# EAGLE design ATMEGA32u4_Breakout_rev1 (EAGLE 9.4.0)
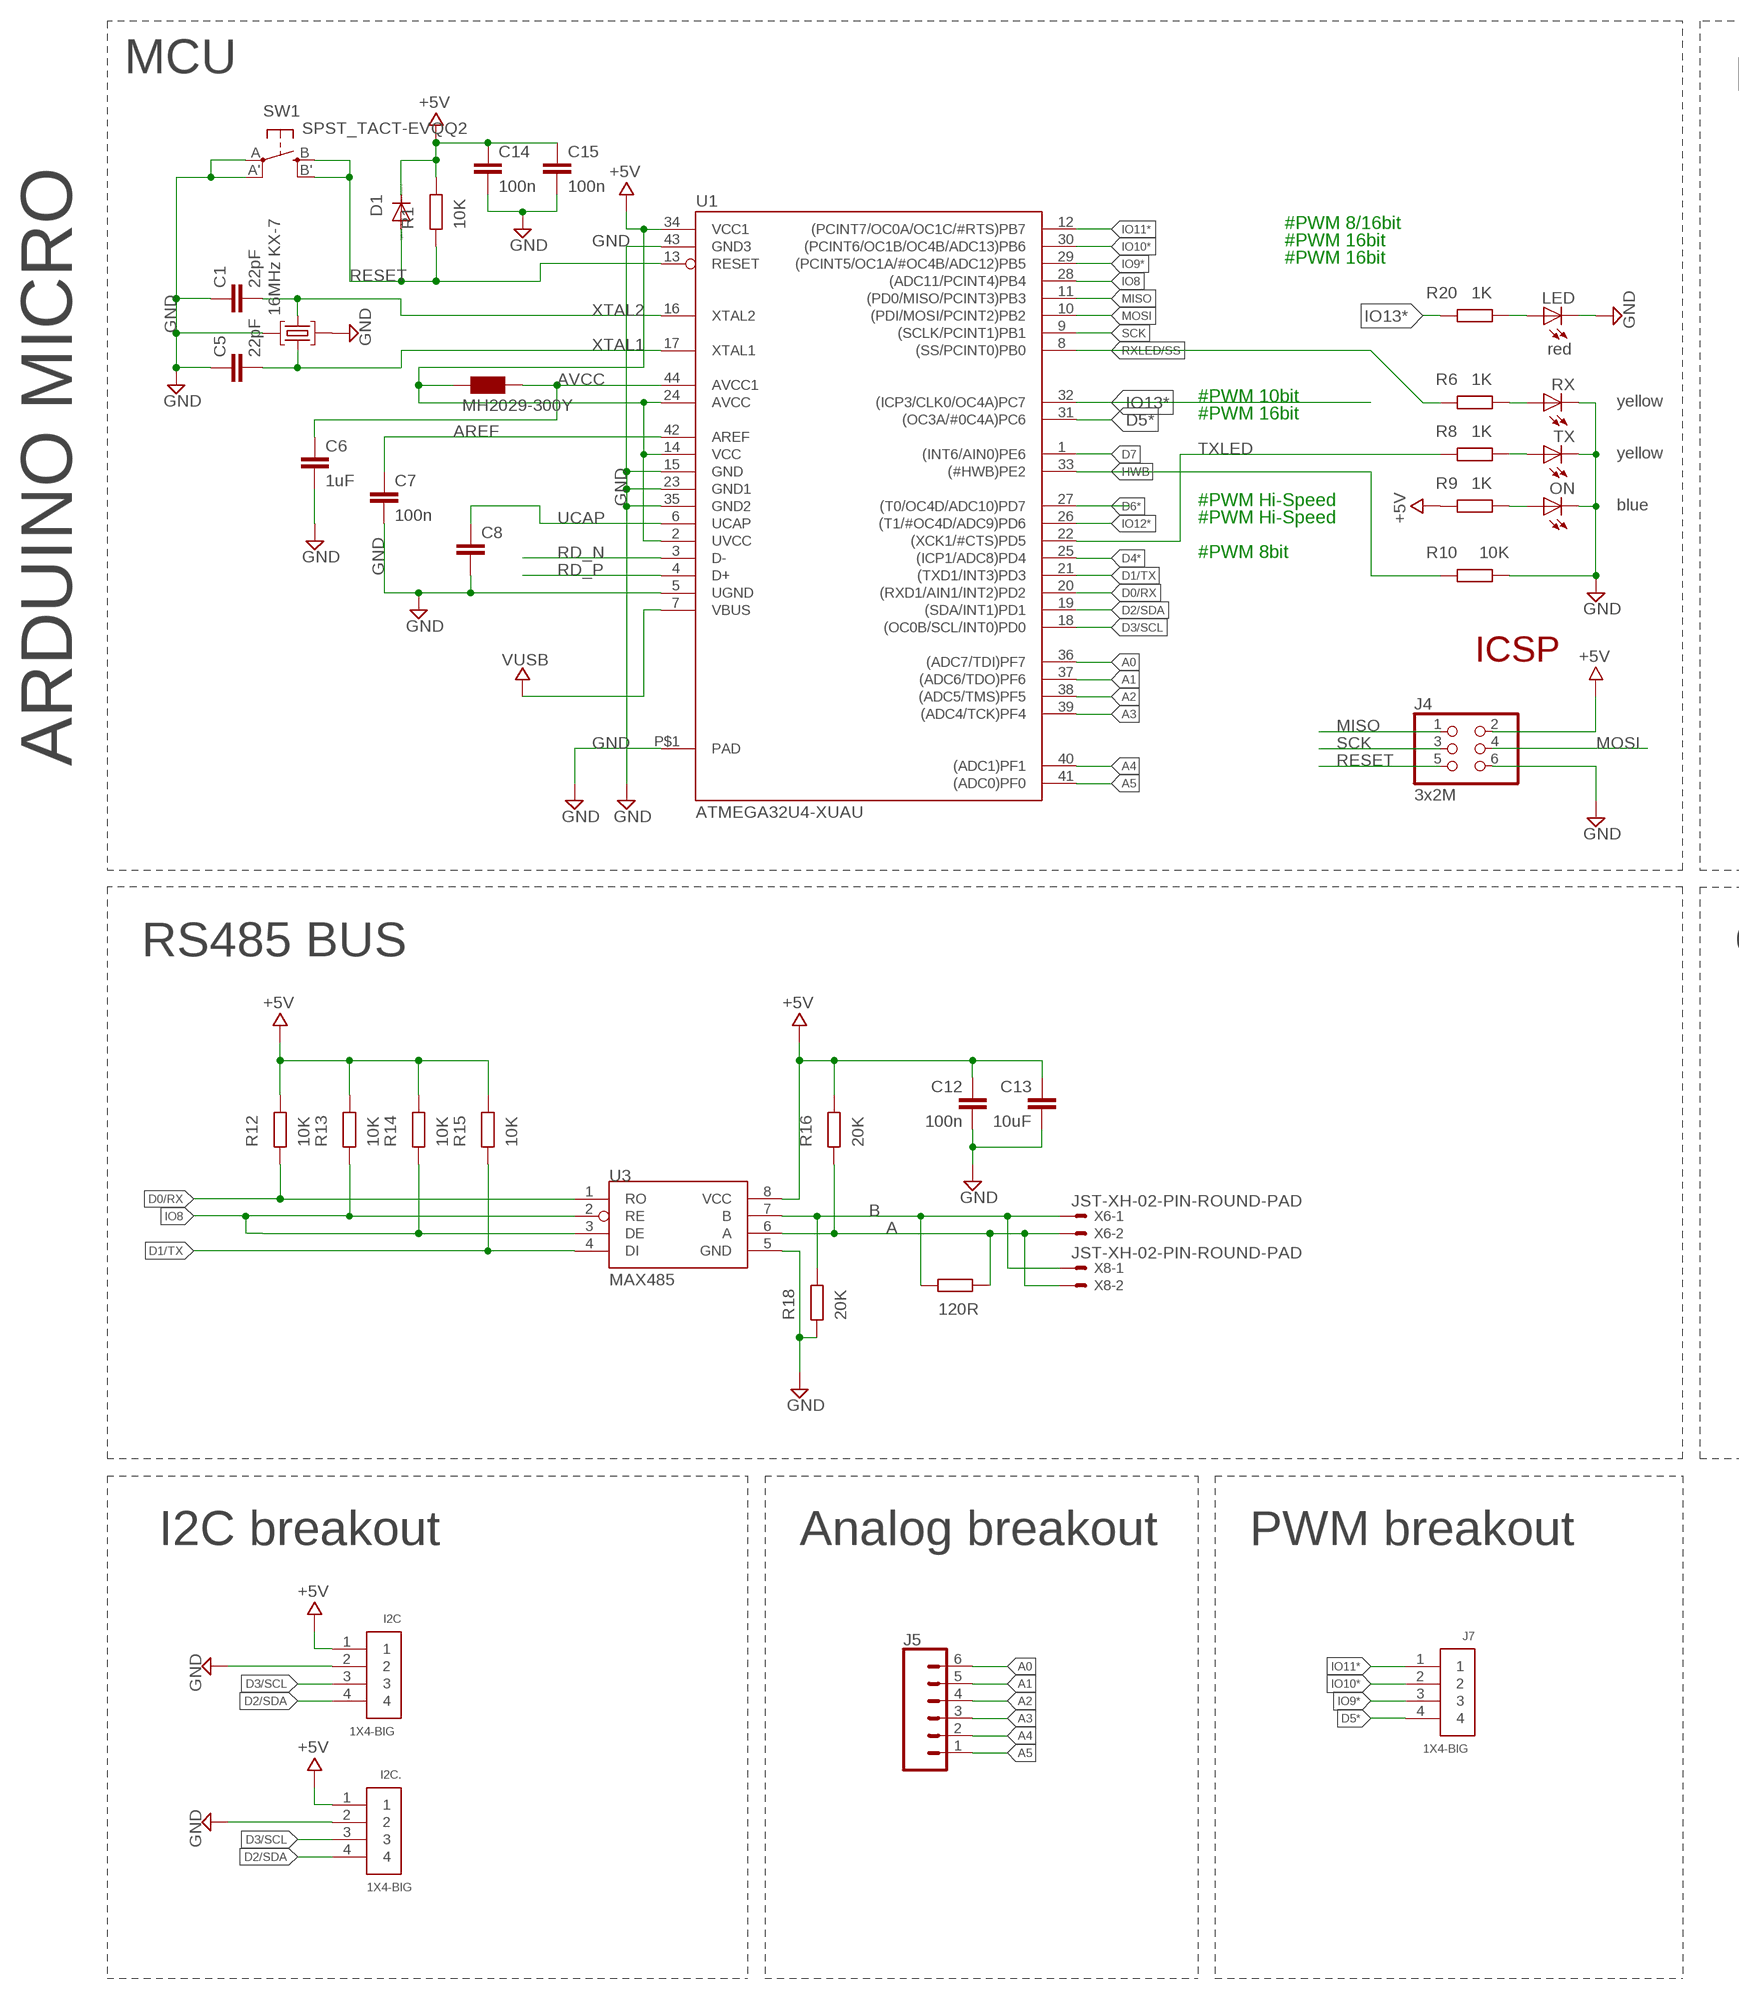
[diagram p0: schematic, sheet 1, part 1 of 2]
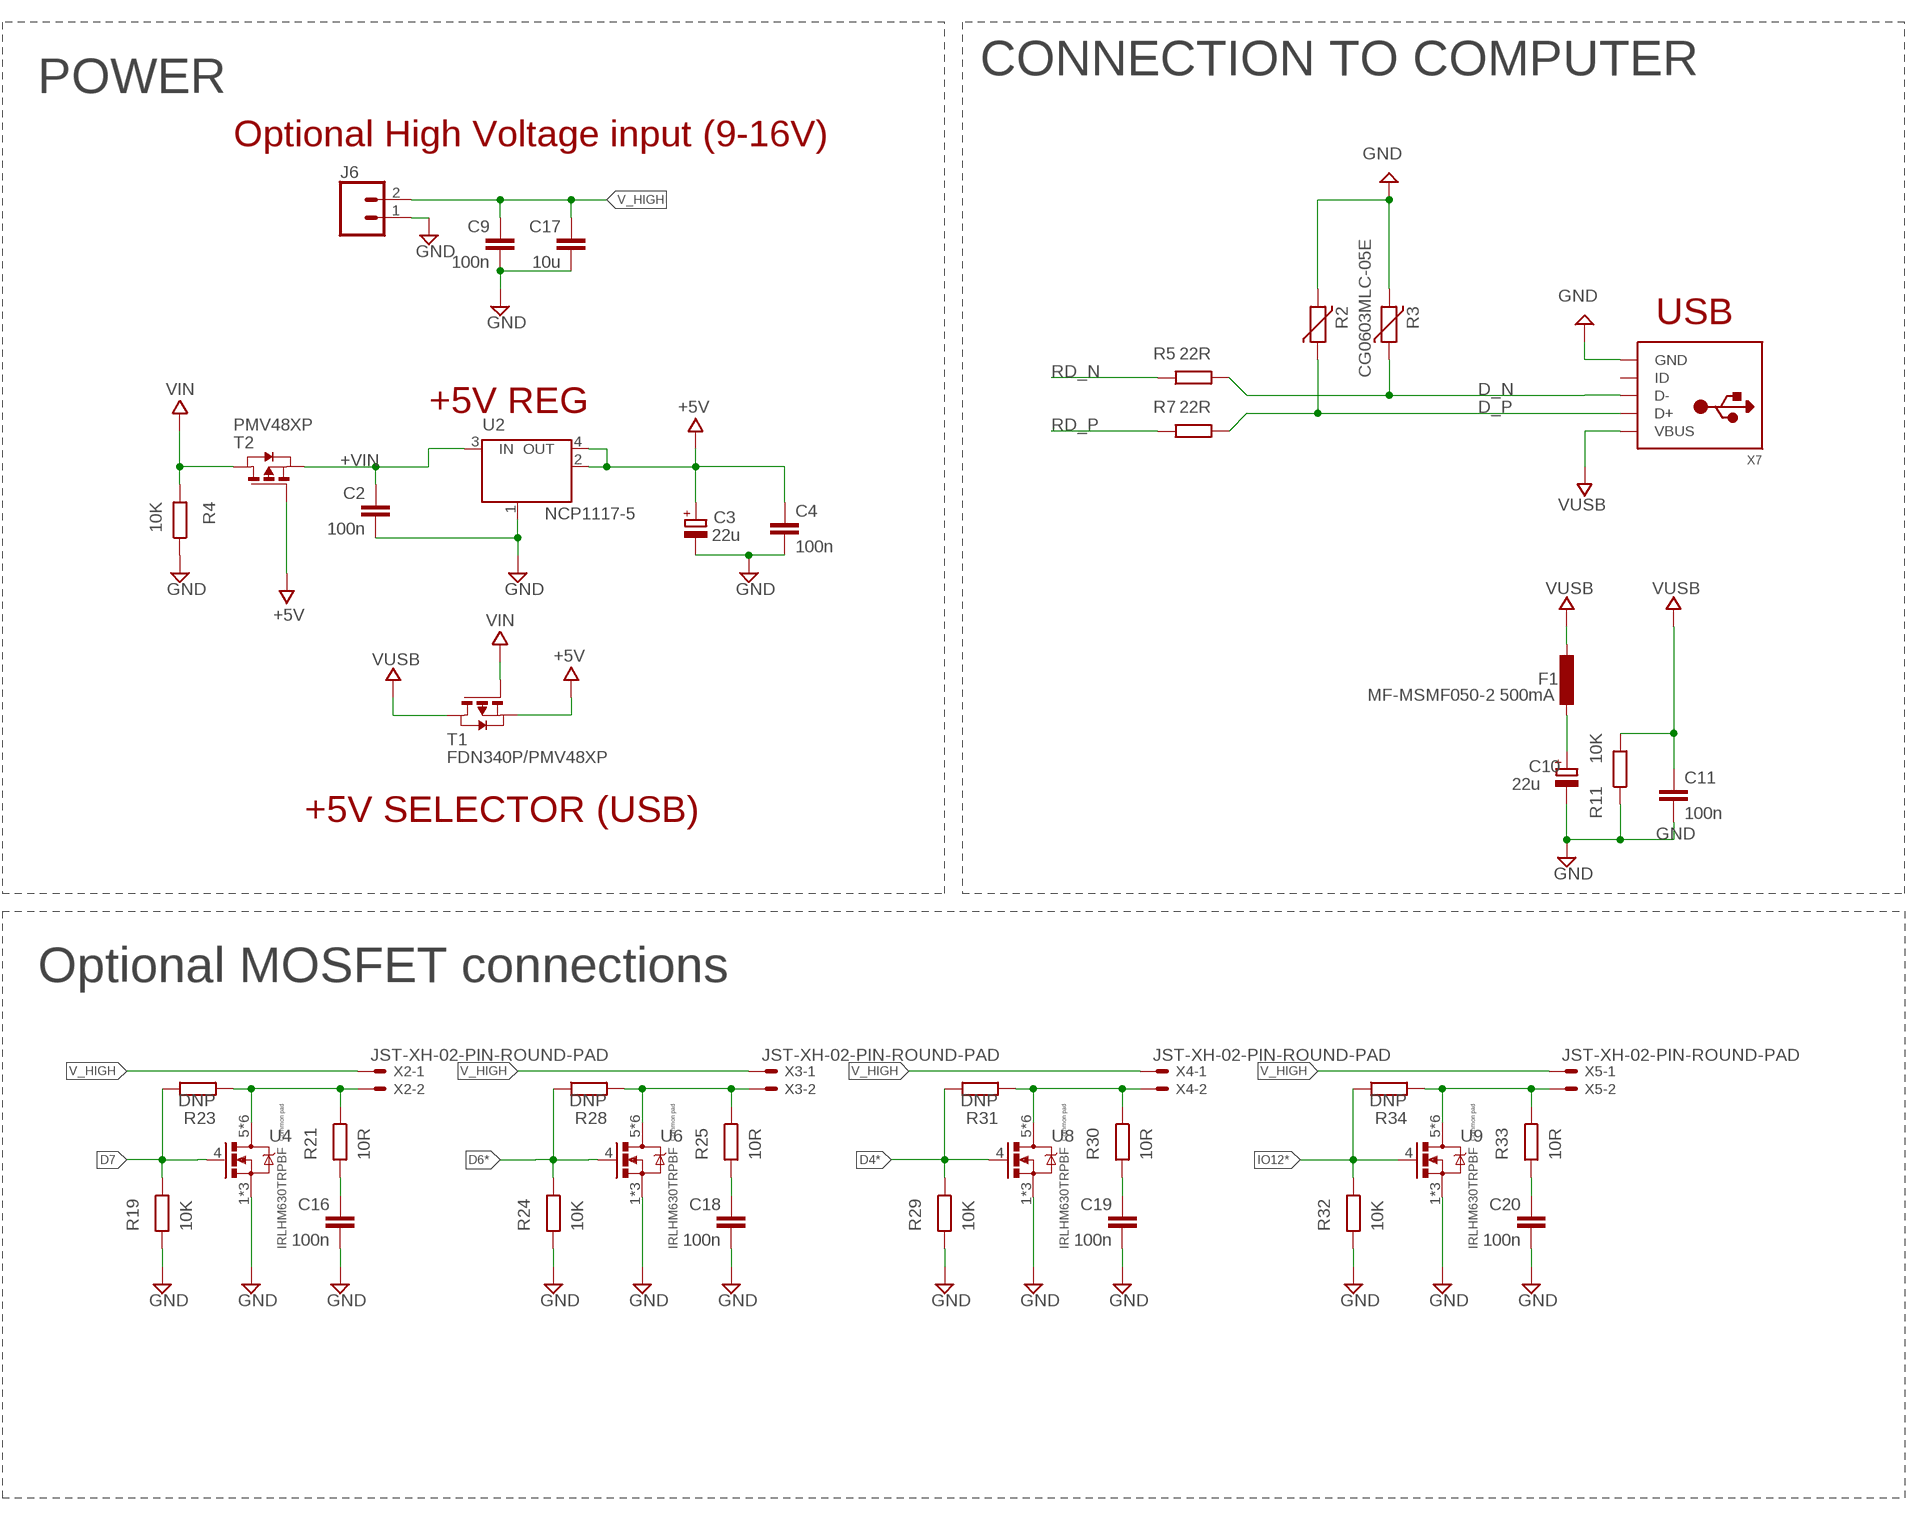
[diagram p1: schematic, sheet 1, part 2 of 2]

## Parts
C1  22pF  C-EUC0603  [C0603-ROUND]
C2  100n  C-EUC0603  [C0603-ROUND]
C3  22u  CPOL-EUSMCB  [SMC_B]
C4  100n  C-EUC0603  [C0603-ROUND]
C5  22pF  C-EUC0603  [C0603-ROUND]
C6  1uF  C-EUC0603  [C0603-ROUND]
C7  100n  C-EUC0603  [C0603-ROUND]
C8  1uF  C-EUC0603  [C0603-ROUND]
C9  100n  C-EUC1206  [C1206]
C10  22u  CPOL-EUSMCB  [SMC_B]
C11  100n  C-EUC0603  [C0603-ROUND]
C12  100n  C-EUC0603  [C0603-ROUND]
C13  10uF  C-EUC0603  [C0603-ROUND]
C14  100n  C-EUC0603  [C0603-ROUND]
C15  100n  C-EUC0603  [C0603-ROUND]
C16  100n  C-EUC0603  [C0603-ROUND]
C17  10u  C-EUC1206  [C1206]
C18  100n  C-EUC0603  [C0603-ROUND]
C19  100n  C-EUC0603  [C0603-ROUND]
C20  100n  C-EUC0603  [C0603-ROUND]
D1  CD1206-S01575  DIODE-MINIMELF  [MINIMELF]
F1  MF-MSMF050-2 500mA  L-EUL1812  [L1812]
I2C  1X4-BIG  [1X04-BIG]
I2C.  1X4-BIG  [1X04-BIG]
J4  3x2M  PINHD-2X3  [2X03]
J5  CONN_06SILK_FEMALE_PTH  [1X06]
J6  CONN_023.5MM  [SCREWTERMINAL-3.5MM-2]
J7  1X4-BIG  [1X04-BIG]
L2  MH2029-300Y  WE-CBF_0805  [0805]
LED  red  LEDCHIPLED_0805  [CHIPLED_0805]
ON  blue  LEDCHIPLED_0805  [CHIPLED_0805]
R1  10K  R-EU_R0603  [R0603-ROUND]
R2  CG0603MLC-05E  VARISTORCN0603  [CT/CN0603]
R3  CG0603MLC-05E  VARISTORCN0603  [CT/CN0603]
R4  10K  R-EU_R0603  [R0603-ROUND]
R5  22R  R-EU_R0603  [R0603-ROUND]
R6  1K  R-EU_R0603  [R0603-ROUND]
R7  22R  R-EU_R0603  [R0603-ROUND]
R8  1K  R-EU_R0603  [R0603-ROUND]
R9  1K  R-EU_R0603  [R0603-ROUND]
R10  10K  R-EU_R0603  [R0603-ROUND]
R11  10K  R-EU_R0603  [R0603-ROUND]
R12  10K  R-EU_R0603  [R0603-ROUND]
R13  10K  R-EU_R0603  [R0603-ROUND]
R14  10K  R-EU_R0603  [R0603-ROUND]
R15  10K  R-EU_R0603  [R0603-ROUND]
R16  20K  R-EU_R0603  [R0603-ROUND]
R17  120R  R-EU_R0603  [R0603-ROUND]
R18  20K  R-EU_R0603  [R0603-ROUND]
R19  10K  R-EU_R0603  [R0603-ROUND]
R20  1K  R-EU_R0603  [R0603-ROUND]
R21  10R  R-EU_R0603  [R0603-ROUND]
R23  DNP  R-EU_R0603  [R0603-ROUND]
R24  10K  R-EU_R0603  [R0603-ROUND]
R25  10R  R-EU_R0603  [R0603-ROUND]
R28  DNP  R-EU_R0603  [R0603-ROUND]
R29  10K  R-EU_R0603  [R0603-ROUND]
R30  10R  R-EU_R0603  [R0603-ROUND]
R31  DNP  R-EU_R0603  [R0603-ROUND]
R32  10K  R-EU_R0603  [R0603-ROUND]
R33  10R  R-EU_R0603  [R0603-ROUND]
R34  DNP  R-EU_R0603  [R0603-ROUND]
RX  yellow  LEDCHIPLED_0805  [CHIPLED_0805]
SW1  SPST_TACT-EVQQ2  [EVQ-Q2]
T1  FDN340P/PMV48XP  PMOSSOT23  [SOT-23]
T2  PMV48XP  PMOSSOT23  [SOT-23]
TX  yellow  LEDCHIPLED_0805  [CHIPLED_0805]
U1  ATMEGA32U4-XUAU  [TQFP44-PAD]
U2  NCP1117-5  LINEAR_MC33269ST  [SOT223]
U3  MAX485  [SO08]
U4  IRLHM630TRPBF  [IRLHM630TRPBF]
U6  IRLHM630TRPBF  [IRLHM630TRPBF]
U8  IRLHM630TRPBF  [IRLHM630TRPBF]
U9  IRLHM630TRPBF  [IRLHM630TRPBF]
X1  16MHz KX-7  CRYSTAL-3.2-2.5  [CRYSTAL-3.2-2.5]
X2  JST-XH-02-PIN-ROUND-PAD  [JST-XH-02-PACKAGE-ROUND-PAD]
X3  JST-XH-02-PIN-ROUND-PAD  [JST-XH-02-PACKAGE-ROUND-PAD]
X4  JST-XH-02-PIN-ROUND-PAD  [JST-XH-02-PACKAGE-ROUND-PAD]
X5  JST-XH-02-PIN-ROUND-PAD  [JST-XH-02-PACKAGE-ROUND-PAD]
X6  JST-XH-02-PIN-ROUND-PAD  [JST-XH-02-PACKAGE-ROUND-PAD]
X7  MICROBUILDER_USB_MICRO_20329_V2  [MICROBUILDER_4UCONN_20329_V2]
X8  JST-XH-02-PIN-ROUND-PAD  [JST-XH-02-PACKAGE-ROUND-PAD]

## Nets
+5V: C3.+ C4.1 C12.1 C13.1 C14.1 C15.1 D1.C I2C.1 I2C..1 J4.2 L2.1 R1.1 R9.1 R12.1 R13.1 R14.1 R15.1 R16.1 T1.2(S) T2.3(G) U1.2(UVCC) U1.14(VCC) U1.24(AVCC) U1.34(VCC1) U2.2(OUT) U2.4(OUT) U3.8(VCC)
+VIN: C2.1 T2.2(S) U2.3(IN)
A: R16.2 R17.1 U3.6(A) X6.2 X8.2
A0: J5.6 U1.36((ADC7/TDI)PF7)
A1: J5.5 U1.37((ADC6/TDO)PF6)
A2: J5.4 U1.38((ADC5/TMS)PF5)
A3: J5.3 U1.39((ADC4/TCK)PF4)
A4: J5.2 U1.40((ADC1)PF1)
A5: J5.1 U1.41((ADC0)PF0)
AREF: C7.1 U1.42(AREF)
AVCC: C6.1 L2.2 U1.44(AVCC1)
B: R17.2 R18.1 U3.7(B) X6.1 X8.1
D0/RX: R12.2 U1.20((RXD1/AIN1/INT2)PD2) U3.1(RO)
D1/TX: R15.2 U1.21((TXD1/INT3)PD3) U3.4(DI)
D2/SDA: I2C.4 I2C..4 U1.19((SDA/INT1)PD1)
D3/SCL: I2C.3 I2C..3 U1.18((OC0B/SCL/INT0)PD0)
D4*: R29.1 R31.1 U1.25((ICP1/ADC8)PD4) U8.4
D5*: J7.4 U1.31((OC3A/#0C4A)PC6)
D6*: R24.1 R28.1 U1.27((T0/OC4D/ADC10)PD7) U6.4
D7: R19.1 R23.1 U1.1((INT6/AIN0)PE6) U4.4
D_N: R3.1 R5.2 X7.D-
D_P: R2.1 R7.2 X7.D+
GND: C1.1 C2.2 C3.- C4.2 C5.1 C6.2 C7.2 C8.2 C9.2 C10.- C11.2 C12.2 C13.2 C14.2 C15.2 C16.2 C17.2 C18.2 C19.2 C20.2 I2C.2 I2C..2 J4.6 J6.1 LED.C ON.C R2.2 R3.2 R4.1 R10.2 R11.1 R18.2 R19.2 R24.2 R29.2 R32.2 RX.C SW1.A'(P1) SW1.A(P) TX.C U1.5(UGND) U1.15(GND) U1.23(GND1) U1.35(GND2) U1.43(GND3) U1.P$1(PAD) U2.1(GND/ADJ) U3.5(GND) U4.1 U4.2 U4.3 U6.1 U6.2 U6.3 U8.1 U8.2 U8.3 U9.1 U9.2 U9.3 X1.2(GND) X1.4(GND) X7.BASE@1(GND) X7.BASE@2(GND) X7.GND X7.SPRT@1(GND) X7.SPRT@2(GND) X7.SPRT@3(GND) X7.SPRT@4(GND)
HWB: R10.1 U1.33((#HWB)PE2)
IO8: R13.2 R14.2 U1.28((ADC11/PCINT4)PB4) U3.2(RE) U3.3(DE)
IO9*: J7.3 U1.29((PCINT5/OC1A/#OC4B/ADC12)PB5)
IO10*: J7.2 U1.30((PCINT6/OC1B/OC4B/ADC13)PB6)
IO11*: J7.1 U1.12((PCINT7/OC0A/OC1C/#RTS)PB7)
IO12*: R32.1 R34.1 U1.26((T1/#OC4D/ADC9)PD6) U9.4
IO13*: R20.1 U1.32((ICP3/CLK0/OC4A)PC7)
MISO: J4.1 U1.11((PD0/MISO/PCINT3)PB3)
MOSI: J4.4 U1.10((PDI/MOSI/PCINT2)PB2)
N$2: R6.2 RX.A
N$3: ON.A R9.2
N$4: R8.2 TX.A
N$5: C16.1 R21.2
N$6: LED.A R20.2
N$9: R21.1 R23.2 U4.5 U4.6 U4.7 U4.8 U4.9 U4.10 X2.2
N$12: C18.1 R25.2
N$13: R25.1 R28.2 U6.5 U6.6 U6.7 U6.8 U6.9 U6.10 X3.2
N$14: C19.1 R30.2
N$15: R30.1 R31.2 U8.5 U8.6 U8.7 U8.8 U8.9 U8.10 X4.2
N$16: C20.1 R33.2
N$17: R33.1 R34.2 U9.5 U9.6 U9.7 U9.8 U9.9 U9.10 X5.2
RD_N: R5.1 U1.3(D-)
RD_P: R7.1 U1.4(D+)
RESET: D1.A J4.5 R1.2 SW1.B'(S1) SW1.B(S) U1.13(RESET)
RXLED/SS: R6.1 U1.8((SS/PCINT0)PB0)
SCK: J4.3 U1.9((SCLK/PCINT1)PB1)
TXLED: R8.1 U1.22((XCK1/#CTS)PD5)
UCAP: C8.1 U1.6(UCAP)
V_HIGH: C9.1 C17.1 J6.2 X2.1 X3.1 X4.1 X5.1
VIN: R4.2 T1.3(G) T2.1(D)
VUSB: C11.1 F1.2 R11.2 T1.1(D) U1.7(VBUS) X7.VBUS
VUSBD: C10.+ F1.1
XTAL1: C5.2 U1.17(XTAL1) X1.3(C2)
XTAL2: C1.2 U1.16(XTAL2) X1.1(C1)
Unconnected: X7.ID

## Notes on the sheet
- MCU | CONNECTION TO COMPUTER
- POWER
- Optional High Voltage input (9-16V)
- #PWM 8/16bit
- #PWM 16bit
- #PWM 16bit
- USB
- #PWM 10bit | +5V REG
- #PWM 16bit
- #PWM Hi-Speed
- #PWM Hi-Speed
- #PWM 8bit
- ICSP
- ARDUINO MICRO
- +5V SELECTOR (USB)
- RS485 BUS | Optional MOSFET connections
- I2C breakout | Analog breakout | PWM breakout

## Library data of the parts
C1 C2 C4-C9 C11-C20 = gen_comp:C-EU: CAPACITOR, European symbol
C3 C10 = rcl:CPOL-EU: POLARIZED CAPACITOR, European symbol; SPICEPREFIX: C
D1 = diode:DIODE-: DIODE
F1 = rcl:L-EU: INDUCTOR, European symbol; SPICEPREFIX: L
I2C I2C. J7 = adafruit:1X4: 4-pin connector
J4 = gen_comp:PINHD-2X3: PIN HEADER
J5 = SparkFun-Connectors:CONN_06: Multi connection point. Often used as Generic Header-pin footprint for 0.1 inch spaced/style header connections On any of the 0.1 inch spaced packages, you can populate with these: Break Away Headers - Straight <https://www.sparkfun.com/products/116> (PRT-00116) Break Away Male Headers - Right Angle <https://www.sparkfun.com/products/553> (PRT-00553) Female Headers <https://www.sparkfun.com/products/115> (PRT-00115) Break Away Headers - Machine Pin <https://www.sparkfun.com/products/117> (PRT-00117) Break Away Female Headers - Swiss Machine Pin <https://www.sparkfun.com/products/743> (PRT-00743) Arduino Stackable Header - 6 Pin <https://www.sparkfun.com/products/9280> (PRT-09280) For SCREWTERMINALS and SPRING TERMINALS visit here: Screw Terimnals on SparkFun.com <https://www.sparkfun.com/search/results?term=Screw+Terminals> (5mm/3.5mm/2.54mm spacing) This device is also useful as a general connection point to wire up your design to another part of your project. Our various solder wires solder well into these plated through hole pads. Hook-Up Wire - Assortment (Stranded, 22 AWG) <https://www.sparkfun.com/products/11375> (PRT-11375) Hook-Up Wire - Assortment (Solid Core, 22 AWG) <https://www.sparkfun.com/products/11367> (PRT-11367) View the entire wire category on our website here <https://www.sparkfun.com/categories/141>; PROD_ID: CONN-08437
J6 = SparkFun-Connectors:CONN_02: Multi connection point. Often used as Generic Header-pin footprint for 0.1 inch spaced/style header connections On any of the 0.1 inch spaced packages, you can populate with these: Break Away Headers - Straight <https://www.sparkfun.com/products/116> (PRT-00116) Break Away Male Headers - Right Angle <https://www.sparkfun.com/products/553> (PRT-00553) Female Headers <https://www.sparkfun.com/products/115> (PRT-00115) Break Away Headers - Machine Pin <https://www.sparkfun.com/products/117> (PRT-00117) Break Away Female Headers - Swiss Machine Pin <https://www.sparkfun.com/products/743> (PRT-00743) For SCREWTERMINALS and SPRING TERMINALS visit here: Screw Terimnals on SparkFun.com <https://www.sparkfun.com/search/results?term=Screw+Terminals> (5mm/3.5mm/2.54mm spacing) This device is also useful as a general connection point to wire up your design to another part of your project. Our various solder wires solder well into these plated through hole pads. Hook-Up Wire - Assortment (Stranded, 22 AWG) <https://www.sparkfun.com/products/11375> (PRT-11375) Hook-Up Wire - Assortment (Solid Core, 22 AWG) <https://www.sparkfun.com/products/11367> (PRT-11367) View the entire wire category on our website here <https://www.sparkfun.com/categories/141> Special notes: Molex polarized connector foot print use with: PRT-08233 with associated crimp pins and housings. 2.54_SCREWTERM for use with PRT-10571. 3.5mm Screw Terminal footprints for PRT-08084 5mm Screw Terminal footprints for use with PRT-08432; PROD_ID: CONN-08399
L2 = wuerth-elektronik:WE-CBF: SMD EMI Suppression Ferrite Beads - excellent anti-EMI properties - low DCR - impedances till 3000 ohms - rated current up to 6 A
LED ON RX TX = led:LED: LED OSRAM: - CHIPLED LG R971, LG N971, LY N971, LG Q971, LY Q971, LO R971, LY R971 LH N974, LH R974 LS Q976, LO Q976, LY Q976 LO Q996 - Hyper CHIPLED LW Q18S LB Q993, LB Q99A, LB R99A - SideLED LS A670, LO A670, LY A670, LG A670, LP A670 LB A673, LV A673, LT A673, LW A673 LH A674 LY A675 LS A676, LA A676, LO A676, LY A676, LW A676 LS A679, LY A679, LG A679 - Hyper Micro SIDELED® LS Y876, LA Y876, LO Y876, LY Y876 LT Y87S - SmartLED LW L88C, LW L88S LB L89C, LB L89S, LG L890 LS L89K, LO L89K, LY L89K LS L896, LA L896, LO L896, LY L896 - TOPLED LS T670, LO T670, LY T670, LG T670, LP T670 LSG T670, LSP T670, LSY T670, LOP T670, LYG T670 LG T671, LOG T671, LSG T671 LB T673, LV T673, LT T673, LW T673 LH T674 LS T676, LA T676, LO T676, LY T676, LB T676, LH T676, LSB T676, LW T676 LB T67C, LV T67C, LT T67C, LS T67K, LO T67K, LY T67K, LW E67C LS E67B, LA E67B, LO E67B, LY E67B, LB E67C, LV E67C, LT E67C LW T67C LS T679, LY T679, LG T679 LS T770, LO T770, LY T770, LG T770, LP T770 LB T773, LV T773, LT T773, LW T773 LH T774 LS E675, LA E675, LY E675, LS T675 LS T776, LA T776, LO T776, LY T776, LB T776 LHGB T686 LT T68C, LB T68C - Hyper Mini TOPLED® LB M676 - Mini TOPLED Santana® LG M470 LS M47K, LO M47K, LY M47K Source: http://www.osram.convergy.de LUXEON: - LUMILED® LXK2-PW12-R00, LXK2-PW12-S00, LXK2-PW14-U00, LXK2-PW14-V00 LXK2-PM12-R00, LXK2-PM12-S00, LXK2-PM14-U00 LXK2-PE12-Q00, LXK2-PE12-R00, LXK2-PE12-S00, LXK2-PE14-T00, LXK2-PE14-U00 LXK2-PB12-K00, LXK2-PB12-L00, LXK2-PB12-M00, LXK2-PB14-N00, LXK2-PB14-P00, LXK2-PB14-Q00 LXK2-PR12-L00, LXK2-PR12-M00, LXK2-PR14-Q00, LXK2-PR14-R00 LXK2-PD12-Q00, LXK2-PD12-R00, LXK2-PD12-S00 LXK2-PH12-R00, LXK2-PH12-S00 LXK2-PL12-P00, LXK2-PL12-Q00, LXK2-PL12-R00 Source: www.luxeon.com KINGBRIGHT: KA-3528ASYC Source: www.kingbright.com
R1 R4-R21 R23-R25 R28-R34 = gen_comp:R-EU_: RESISTOR, European symbol
R2 R3 = varistor:VARISTOR: VARISTOR
SW1 = adafruit:SPST_TACT: SMT 6mm switch, EVQQ2 series http://www.ladyada.net/library/eagle
T1 T2 = zetex:PMOSSOT23: MOS FET; OC_FARNELL: unknown; OC_NEWARK: unknown
U1 = gen_comp:ATMEGA32U4-XU
U2 = gen_comp:LINEAR_MC33269ST*: Adjustable Output Low Dropout Voltage Regulator 800 mA Source: http://www.onsemi.com/pub/Collateral/MC33269-D.PDF
U3 = MAX485:MAX485; AVAILABILITY: Unavailable; MF: Maxim Integrated; MP: MAX485; PACKAGE: None; PRICE: None
U4 U6 U8 U9 = IRLHM630TRPBF:IRLHM630TRPBF
X1 = gen_comp:CRYSTAL-3.2-2.5
X2-X6 X8 = con-jst-xh:JST-XH-02-PIN: JST XH Connector 2 Pin Wire to board connector. Pitch: 2,54 mm, (0.100") Number of pins: 2 Created by Rembrandt Electronics www.rembrandtelectronics.com
X7 = Adafruit ESP8266 Feather rev E:MICROBUILDER_USB: USB Connectors USBMINIB - Surface Mount Female Mini-B USB Connector 4UConnector: 06564

## Board
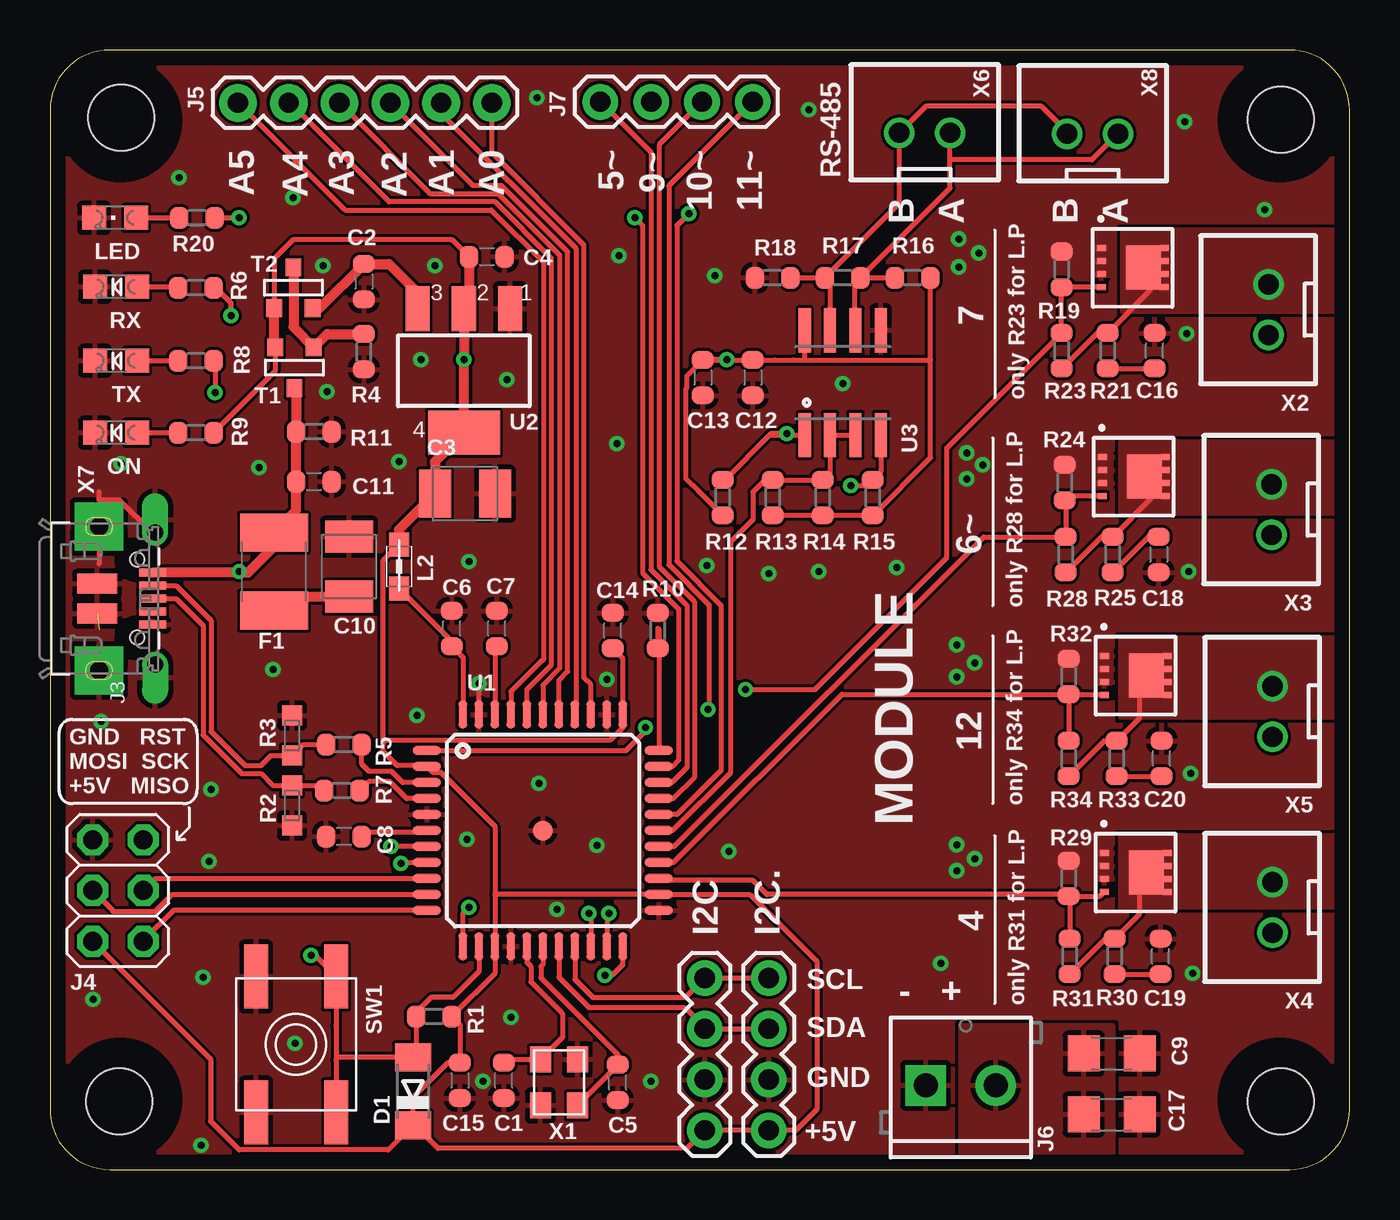
[diagram p2: board, top side]
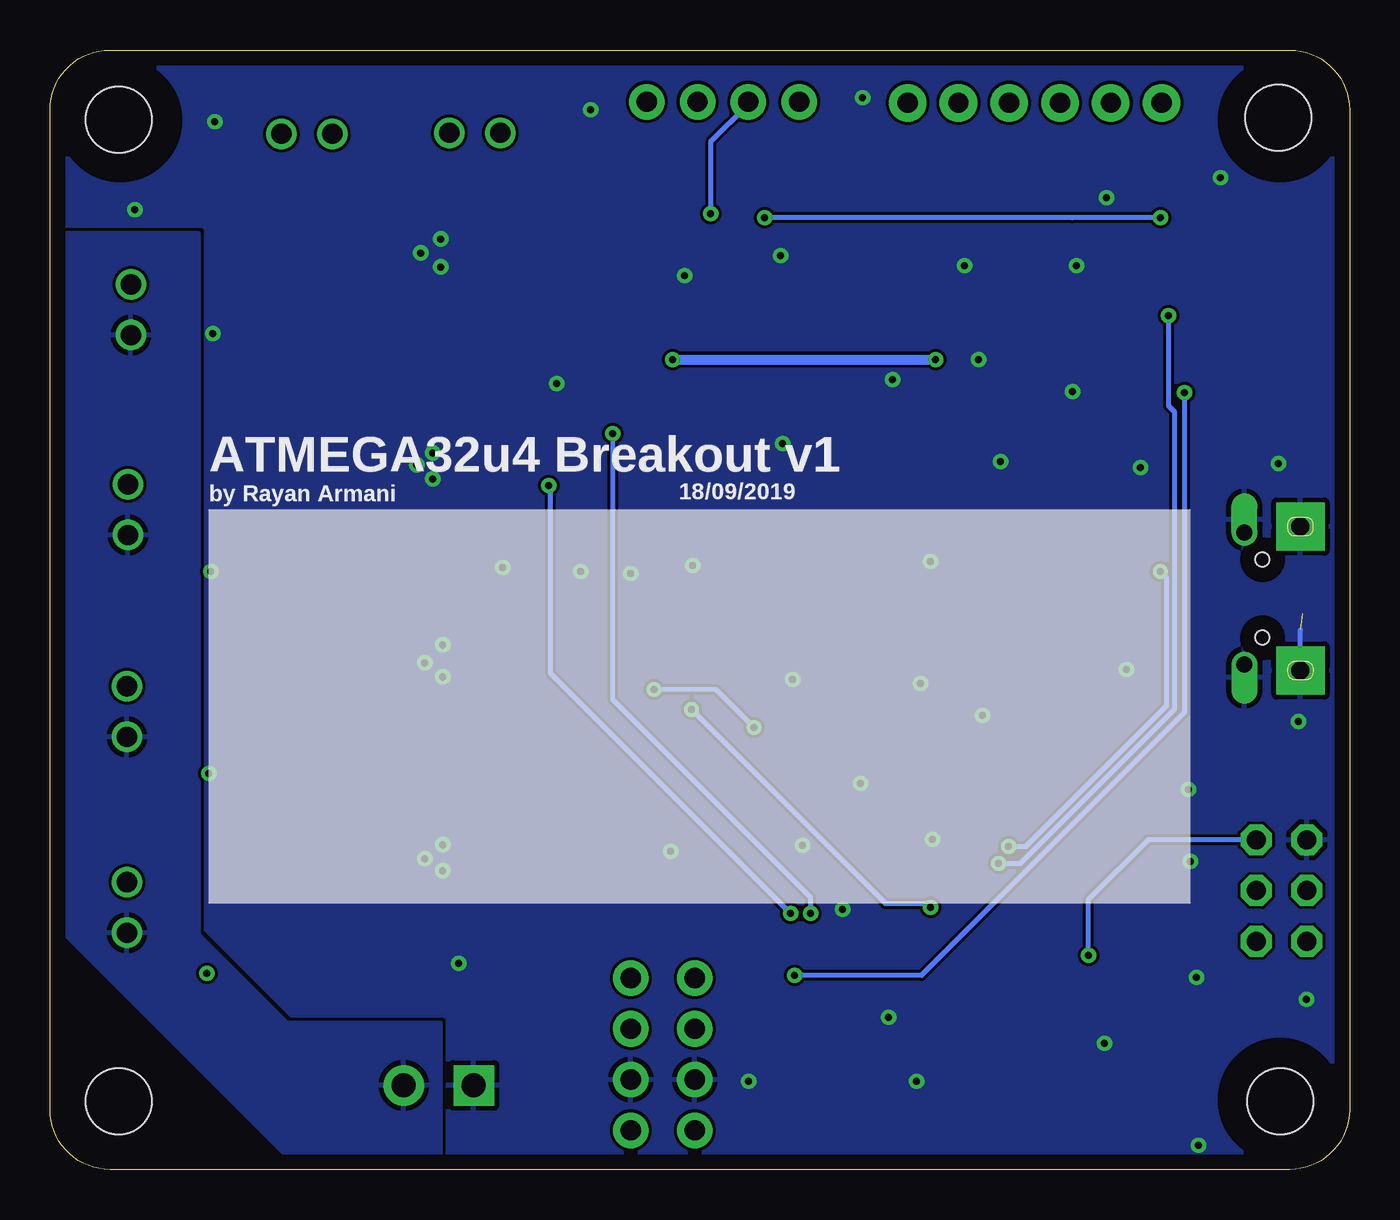
[diagram p3: board, bottom side, seen from below]

Size 65 x 56 mm. Coordinates in mm from the lower left corner, seen from the top.
Outline: 0,3 arc90 3,0 62,0 arc90 65,3 65,53 arc90 62,56 3,56 arc90 0,53 0,18.5 0,3
Copper layers (1*16): Top 0.035mm / dielectric 1.5mm / Bottom 0.035mm
Design rules "default *": minimum track width 6mil, minimum drill 0.35mm, track to track 6mil, track to pad 6mil, pad to pad 6mil, via to via 6mil, smd to smd 6mil, copper to edge 30mil, drill to drill 6mil, minimum pad ring 10mil, minimum via ring 8mil, stop-mask expansion 4mil, vias tented up to drill 0.4mm, thermal gap 10mil
Holes 3.3 mm at 3.55,52.61 61.55,52.51 61.55,3.41 3.45,3.41
tRestrict: area 1.9,51 to 5,54; area 60,51 to 63,54; area 60,1.9 to 63,5.1; area 1.9,1.9 to 5,5.1
bRestrict: area 1.9,1.9 to 5,5.1; area 1.9,51 to 5,54; area 60,1.9 to 63,5.1; area 60,51 to 63,54

### Footprints (pad centres in the part's own frame; a part is rotated, then mirrored left to right if it is on the bottom)
C0603-ROUND = smd 0.898 x 1.1: 1 -0.889,0; 2 0.889,0
SMC_B = smd 1.6 x 2.4: + -1.5,0; - 1.5,0
C1206 = smd 1.6 x 1.8: 1 -1.4,0; 2 1.4,0
MINIMELF = smd 1.4 x 1.8: A 1.7,0; C -1.7,0
L1812 = smd 1.9 x 3.4: 1 -1.95,0; 2 1.95,0
1X04-BIG = drill 1.016 pad 1.778: 1 0,0; 2 2.54,0; 3 5.08,0; 4 7.62,0
2X03 = drill 0.95 pad 1.55 octagon: 1 -2.54,-1.27; 2 -2.54,1.27; 3 0,-1.27; 4 0,1.27; 5 2.54,-1.27; 6 2.54,1.27
1X06 = drill 1.016 pad 1.88: 1 0,0; 2 2.54,0; 3 5.08,0; 4 7.62,0; 5 10.16,0; 6 12.7,0
SCREWTERMINAL-3.5MM-2 = drill 1.2 pad 2.032 square: 1 0,0 | drill 1.2 pad 2.032: 2 3.5,0
0805 = smd 1.2 x 1: 1 -1.1,0; 2 1.1,0
CHIPLED_0805 = smd 1.2 x 1.2: A 0,-1.05; C 0,1.05
R0603-ROUND = smd 0.898 x 1.1: 1 -0.889,0; 2 0.889,0
CT/CN0603 = smd 1 x 1: 1 -1,0; 2 1,0
EVQ-Q2 = smd 3.2 x 1.2: A -3.4,-2; A' 3.4,-2; B -3.4,2; B' 3.4,2
SOT-23 = smd 0.787 x 0.889: 1 0.025,-1.016; 2 -0.94,1.016; 3 0.991,1.016
TQFP44-PAD = smd 1.4 x 0.45: 1 -5.8,4; 2 -5.8,3.2; 3 -5.8,2.4; 4 -5.8,1.6; 5 -5.8,0.8; 6 -5.8,0; 7 -5.8,-0.8; 8 -5.8,-1.6; 9 -5.8,-2.4; 10 -5.8,-3.2; 11 -5.8,-4; 23 5.8,-4; 24 5.8,-3.2; 25 5.8,-2.4; 26 5.8,-1.6; 27 5.8,-0.8; 28 5.8,0; 29 5.8,0.8; 30 5.8,1.6; 31 5.8,2.4; 32 5.8,3.2; 33 5.8,4 | smd 0.45 x 1.4: 12 -4,-5.8; 13 -3.2,-5.8; 14 -2.4,-5.8; 15 -1.6,-5.8; 16 -0.8,-5.8; 17 0,-5.8; 18 0.8,-5.8; 19 1.6,-5.8; 20 2.4,-5.8; 21 3.2,-5.8; 22 4,-5.8; 34 4,5.8; 35 3.2,5.8; 36 2.4,5.8; 37 1.6,5.8; 38 0.8,5.8; 39 0,5.8; 40 -0.8,5.8; 41 -1.6,5.8; 42 -2.4,5.8; 43 -3.2,5.8; 44 -4,5.8 | smd 1 x 1: P$1 0,0
SOT223 = smd 1.219 x 2.235: 1 -2.311,-3.099; 2 0,-3.099; 3 2.311,-3.099 | smd 3.6 x 2.2: 4 0,3.099
SO08 = smd 0.61 x 2.21: 1 -1.905,-2.616; 2 -0.635,-2.616; 3 0.635,-2.616; 4 1.905,-2.616; 5 1.905,2.616; 6 0.635,2.616; 7 -0.635,2.616; 8 -1.905,2.616
IRLHM630TRPBF = smd 0.3 x 0.45: 1 0.975,1.575; 2 0.325,1.575; 3 -0.325,1.575; 4 -0.975,1.575; 5 -0.975,-1.575; 6 -0.325,-1.575; 7 0.325,-1.575; 8 0.975,-1.575 | smd 2.184 x 1.067: 9 0,-0.2; 10 0,-0.87
CRYSTAL-3.2-2.5 = smd 1.3 x 1.05: 1 -1.15,-0.925; 2 1.15,-0.925; 3 1.15,0.925; 4 -1.15,0.925
JST-XH-02-PACKAGE-ROUND-PAD = drill 1.016: 1 -1.27,0; 2 1.27,0
MICROBUILDER_4UCONN_20329_V2 = smd 1 x 2: BASE@1 -0.75,-2; BASE@2 0.75,-2 | smd 0.4 x 1.35: D+ 0,0.775; D- -0.65,0.775; GND 1.3,0.775; ID 0.65,0.775; VBUS -1.3,0.775 | drill 0.8 pad 1.143 offset: SPRT@1 -3.3,0.9; SPRT@2 3.3,0.9 | drill 0.9 pad 2.413 square: SPRT@3 -3.6,-1.9; SPRT@4 3.6,-1.9 | hole 0.7: -1.95,0; 1.95,0

### Placement (x,y rotation side)
C1  22.7,4.46 90 top
C2  15.7,44.41 270 top
C3  20.75,33.81 0 top
C4  21.85,45.66 0 top
C5  28.4,4.36 90 top
C6  20.1,27.06 90 top
C7  22.35,27.06 90 top
C8  14.7,16.66 180 top
C9  53.1,5.81 0 top
C10  14.95,30.16 90 top
C11  13.2,34.41 0 top
C12  35.15,39.61 270 top
C13  32.65,39.61 270 top
C14  28.15,26.96 90 top
C15  20.5,4.46 270 top
C16  55.25,40.96 90 top
C17  53.1,2.76 0 top
C18  55.45,30.76 270 top
C19  55.55,10.66 90 top
C20  55.6,20.56 90 top
D1  18.15,3.91 90 top
F1  11.2,29.91 90 top
I2C  32.75,1.96 90 top
I2C.  35.95,1.96 90 top
J4  3.4,13.96 90 top
J5  9.4,53.36 0 top
J6  43.8,4.21 0 top
J7  35.15,53.41 180 top
L2  17.45,30.16 270 top
LED  3.25,47.61 90 top
ON  3.3,36.86 90 top
R1  19.2,7.66 180 top
R2  12.1,18.21 270 top
R3  12.1,21.71 90 top
R4  15.7,40.91 90 top
R5  14.7,21.26 180 top
R6  7.3,44.11 180 top
R7  14.6,18.96 180 top
R8  7.3,40.46 180 top
R9  7.3,36.86 180 top
R10  30.4,26.96 90 top
R11  13.2,36.91 180 top
R12  33.65,33.61 90 top
R13  36.15,33.61 90 top
R14  38.65,33.61 90 top
R15  41.15,33.61 90 top
R16  43.15,44.61 180 top
R17  39.65,44.61 180 top
R18  36.15,44.61 180 top
R19  50.59,45.02 90 top
R20  7.35,47.61 180 top
R21  52.9,40.96 270 top
R23  50.6,40.96 270 top
R24  50.75,34.36 90 top
R25  53.15,30.76 270 top
R28  50.8,30.76 270 top
R29  50.95,14.56 90 top
R30  53.25,10.66 270 top
R31  51,10.66 270 top
R32  50.95,24.66 90 top
R33  53.35,20.56 270 top
R34  50.95,20.56 270 top
RX  3.3,44.16 90 top
SW1  12.3,6.26 270 top
T1  12.2,40.11 0 top
T2  12.2,44.11 180 top
TX  3.3,40.46 90 top
U1  24.65,16.96 0 top
U2  20.7,39.96 180 top
U3  39.65,39.36 0 top
U4  54.15,45.11 90 top
U6  54.2,34.66 90 top
U8  54.3,14.86 90 top
U9  54.3,24.71 90 top
X1  25.45,4.36 270 top
X2  60.95,43.01 90 top
X3  61.1,33.01 90 top
X4  61.15,13.11 90 top
X5  61.15,22.91 90 top
X6  43.75,51.86 0 top
X7  4.35,28.56 270 top
X8  52.15,51.81 0 top

### Tracks (layer width: path | path; a pad name or v marks a point on that pad's centre or on a via)
+5V  (via drill 0.35)
  Top 0.254: U3.8 37.75,41.77 37.75,40.58 37.67,40.5 | 16.67,21.46 16.67,21.31 16.67,20.91 17.37,20.21 18.8,20.21 U1.2 19.15,19.86 19.56,19.86 22.25,17.17 22.25,11.41 | 16.67,21.46 16.67,30.48 L2.1 | C14.1 28.65,25.57 U1.34 28.65,22.11 28,21.46 16.67,21.46 | R13.1 R14.1 R15.1 44.04,35.61 44.04,40.51 | 44.04,40.51 R16.1 | R12.1 32.46,33.91 32.45,33.91 31.82,34.54 31.82,39.07 31.85,39.1 31.85,39.7 32.61,40.45 | 32.61,40.45 C13.1 C12.1 36.27,40.5 37.17,40.5 37.67,40.5 | 37.67,40.5 44.03,40.5 44.04,40.51 | 22.25,11.41 22.25,13.76 U1.24 35,13.76 38.35,10.41 38.35,3.01 37.3,1.96 I2C..1 I2C.1 31.85,1.06 19.4,1.06 18.15,2.31 | 22.25,11.41 U1.14 22.25,9.82 R1.1 20.5,7.25 C15.1 19.89,5.35 18.15,3.61 18.15,2.31 | 18.15,2.31 D1.C 16.92,0.98 9.47,0.98 8.03,2.42 8.03,5.52 J4.2 | T1.2 11.26,39.93 R9.1 | C4.1 20.11,46.51 12.15,46.51 11.21,45.57 11.21,42.91 | v33.85,40.51 C13.1 32.61,40.45
  Top 0.508: T1.2 11.21,41.18 11.21,42.91 T2.3 | C4.1 20.96,43.32 U2.2 v20.7,40.51 U2.4 | U2.4 20.7,36.51 U2.4 | U2.4 19.25,35.41 C3.+ 17.45,32.01 L2.1
  Bottom 0.508: v33.85,40.51 v20.7,40.51
+VIN
  Top 0.508: T2.2 13.5,43.09 C2.1 16.96,45.3 18.39,43.87 U2.3
A
  Top 0.254: R17.1 40.24,44.31 40.24,42.02 U3.6 | R17.1 R16.2 | R17.1 45.02,49.09 45.02,50.51 | 45.02,50.51 X6.2 | X8.2 52.12,50.51 45.02,50.51
A0
  Top 0.254: U1.36 27.05,24.26 26.71,24.6 26.71,46.25 22.1,50.86 J5.6
A1
  Top 0.254: J5.5 19.56,52.82 26.31,46.08 26.31,22.81 U1.37
A2
  Top 0.254: U1.38 25.45,24.46 25.9,24.91 25.9,45.91 22.59,49.22 21.15,49.22 J5.4
A3
  Top 0.254: J5.3 19.02,48.81 22.42,48.81 25.49,45.74 25.49,25.08 24.65,24.23 U1.39
A4
  Top 0.254: U1.40 23.85,24.01 25.09,25.25 25.09,45.57 22.25,48.41 16.95,48.41 12,53.36 J5.2
A5
  Top 0.254: J5.1 9.7,53.06 14.77,47.99 22.07,47.99 24.68,45.38 24.68,25.52 24.61,25.44 24.58,25.44 23.05,23.91 U1.41
AREF
  Top 0.254: C7.1 22.25,26.07 U1.42
AVCC
  Top 0.254: U1.44 20.65,25.62 C6.1 20.1,26.41 L2.2
B
  Top 0.254: R17.2 38.81,44.56 | 38.81,44.56 39.02,44.35 U3.7 | R18.1 R17.2 | R17.2 38.81,44.56 | R17.2 42.48,48.33 X6.1 43.83,53.21 49.55,53.21 50.88,51.88 X8.1
D0/RX  (via drill 0.35)
  Top 0.254: U3.1 36,36.74 33.75,34.5 R12.2 33.65,34.4 36.06,36.81 v36.85,36.81 | v26.95,12.81 27.05,12.71 U1.20
  Bottom 0.254: v26.95,12.81 26.95,13.61 36.85,23.51 v36.85,36.81
D1/TX  (via drill 0.35)
  Top 0.254: U3.4 41.56,34.9 R15.2 40.86,34.21 v40.05,34.21 | v27.95,12.81 27.85,12.71 U1.21
  Bottom 0.254: v27.95,12.81 39.95,24.81 39.95,34.11 v40.05,34.21
D2/SDA
  Top 0.254: U1.19 26.25,9.51 27.15,8.61 31.78,8.61 I2C.4 I2C..4
D3/SCL
  Top 0.254: U1.18 25.45,9.62 26.96,8.11 31.75,8.11 32.75,7.11 I2C.3 I2C..3
D4*
  Top 0.254: R29.1 50.86,13.76 35.85,13.76 35.15,14.46 30.55,14.46 U1.25 | R29.1 52.51,13.67 U8.4 | R29.1 51,13.62 R31.1
D5*
  Top 0.254: J7.4 30.05,50.89 30.05,30.01 31.85,28.21 31.85,20.11 31.1,19.36 U1.31
D6*
  Top 0.254: U1.27 31.21,16.16 46.7,31.65 R28.1 50.8,33.47 R24.1 50.73,33.49 50.73,33.68 U6.4
D7  (via drill 0.35)
  Top 0.254: U1.1 28.8,20.96 29.95,22.11 v29.79,22.11 | v34.79,24.01 38.25,24.01 44.85,30.61 44.85,36.1 R23.1 R19.1 U4.4
  Bottom 0.254: v29.79,22.11 31.69,24.01 v34.79,24.01
D_N
  Top 0.254: X7.D- 6.31,29.21 8.06,27.46 8.06,21.9 9.75,20.21 10.55,20.21 11.05,20.71 R3.1 12.65,21.26 R5.2
D_P
  Top 0.254: X7.D+ 6.31,28.56 7.65,27.22 7.65,21.73 9.58,19.8 10.55,19.8 11.15,19.21 R2.1 13.46,19.21 R7.2
GND  (via drill 0.35)  (1 unrouted)
  Top 0.254: U1.43 v21.45,24.31 | X7.SPRT@1 5.11,31.86 3.47,33.5 2.45,33.5 2.45,33.91 | X7.SPRT@3 2.45,30.31
  Bottom 0.254: X7.SPRT@4 2.45,27.01
  other vias: 45.85,35.85 45.85,34.55 46.65,35.25 45.45,46.55 45.45,45.15 46.45,45.85 45.35,26.25 45.35,24.65 46.25,25.35 45.35,16.25 45.35,14.95 46.25,15.55 12.25,6.31 7.55,1.21 2.15,8.51 7.65,9.61 7.95,15.41 8.05,19.01 11.15,25.01 3.55,35.31 6.45,49.61 10.45,35.11 13.85,38.91 12.15,48.61 17.45,35.41 19.25,45.21 28.45,45.71 28.35,36.31 20.95,30.41 27.85,24.51 18.35,22.71 24.45,19.31 20.85,16.51 27.35,16.21 25.35,13.01 23.05,7.61 21.65,4.41 30.05,4.41 33.95,15.91 32.85,30.21 35.95,29.81 38.45,29.91 42.35,30.11 39.65,39.31 33.25,44.71 37.95,53.01 24.35,53.61 56.75,52.41 60.75,48.01 56.85,41.81 56.95,29.91 57.05,19.81 57.15,9.81 44.55,10.31 13.65,45.21 18.55,40.51 22.85,39.51 2.55,22.41
  pour Top (no thermals): 45.05,47.01 53.15,47.01 53.15,44.71 45.05,44.71
  pour Top (no thermals): 44.95,36.31 53.05,36.31 53.05,34.01 44.95,34.01
  pour Top (no thermals): 44.95,26.61 53.05,26.61 53.05,24.31 44.95,24.31
  pour Top (no thermals): 44.95,16.71 53.05,16.71 53.05,14.51 44.95,14.51
  pour Top (rank 2): -1.05,56.21 65.75,56.21 65.75,-0.49 -1.05,-0.49
  pour Bottom (rank 2): -0.95,56.01 65.85,56.01 65.85,-0.49 -0.95,-0.49
HWB
  Top 0.254: R10.1 30.4,27.08 30.45,27.03 U1.33
IO8
  Top 0.254: U3.3 U3.2 39.02,34.86 R14.2 R13.2 35.75,34.5 35.15,33.9 35.15,32.51 34.05,31.41 34.05,19.87 31.14,16.96 U1.28
IO9*  (via drill 0.35)
  Top 0.254: U1.29 31.36,17.75 33.57,19.97 33.57,28.21 31.36,30.43 31.36,47.22 v31.95,47.81
  Bottom 0.254: J7.3 30.07,53.29 31.95,51.41 v31.95,47.81
IO10*
  Top 0.254: U1.30 31.17,18.55 32.26,19.64 32.26,28.38 30.49,30.15 30.49,51.29 J7.2
IO11*  (via drill 0.35)
  Top 0.254: J7.1 30.95,49.21 30.95,30.26 32.96,28.25 32.96,23.06 v32.91,23.01 | v20.95,13.11 20.65,12.8 U1.12
  Bottom 0.254: v32.91,23.01 23.21,13.31 21.15,13.31 v20.95,13.11
IO12*
  Top 0.254: R32.1 39.6,23.77 31.19,15.36 U1.26 | R32.1 52.69,23.77 U9.4 | R32.1 R34.1
IO13*  (via drill 0.35)
  Top 0.254: R20.1 v9.45,47.61 | v29.25,47.61 29.64,47.22 29.64,29.84 31.45,28.04 31.45,20.48 31.13,20.16 U1.32
  Bottom 0.254: v9.45,47.61 13.88,47.61 v29.25,47.61
MISO
  Top 0.254: J4.1 4.67,11.45 6.18,12.96 U1.11
MOSI
  Top 0.254: J4.4 3.15,12.94 3.15,12.91 4.23,12.91 5.11,12.91 5.25,12.91 6.1,13.76 U1.10
N$2
  Top 0.254: RX.A 6.36,44.16 R6.2
N$3
  Top 0.254: ON.A R9.2
N$4
  Top 0.254: TX.A R8.2
N$5
  Top 0.254: R21.2 C16.1
N$6
  Top 0.254: LED.A R20.2
N$9
  Top 0.254: R23.2 52.38,41.85 R21.1 55.02,43.97 U4.10
  pour Top (no thermals): 53.65,47.01 64.65,47.01 64.65,42.91 53.65,42.91
N$12
  Top 0.254: R25.2 54.93,31.65 C18.1
N$13
  Top 0.254: R28.2 52.58,31.65 R25.1 55.07,33.57 U6.10
  pour Top (no thermals): 53.55,36.41 64.85,36.41 64.85,32.91 64.95,32.81 53.55,32.81
N$14
  Top 0.254: R30.2 C19.1
N$15
  Top 0.254: R31.2 52.78,11.55 R30.1 54.5,12.8 U8.9
  pour Top (no thermals): 53.55,16.71 64.85,16.71 64.85,13.11 53.55,13.11
N$16
  Top 0.254: R33.2 C20.1
N$17
  Top 0.254: R34.2 52.73,21.45 R33.1 54.5,22.6 U9.9
  pour Top (no thermals): 53.55,26.61 64.95,26.61 64.95,22.61 53.55,22.61
RD_N
  Top 0.254: U1.3 17.64,19.36 17.09,19.91 15.95,19.91 15.59,20.28 R5.1
RD_P
  Top 0.254: U1.4 17.84,18.56 16.99,19.41 15.94,19.41 R7.1
RESET  (via drill 0.35)
  Top 0.254: U1.13 21.45,9.91 20.15,8.61 19.05,8.61 18.31,7.87 R1.2 18.31,7.61 18.31,5.77 D1.A 14.4,5.61 14.3,5.51 | 14.3,5.51 14.3,7.21 SW1.B 14.65,9.31 13.25,10.71 v13.05,10.71 | 14.3,5.51 SW1.B'
  Bottom 0.254: v13.05,10.71 13.05,13.52 10.07,16.5 J4.5
RXLED/SS  (via drill 0.35)
  Top 0.254: R6.1 8.29,44.11 9.05,43.35 v9.05,42.71 | v17.55,15.31 17.6,15.36 U1.8
  Bottom 0.254: v9.05,42.71 9.05,38.21 8.75,37.91 8.75,23.01 16.45,15.31 v17.55,15.31
SCK
  Top 0.254: J4.3 5.27,14.56 U1.9
TXLED  (via drill 0.35)
  Top 0.254: U1.22 28.65,10.26 28.1,9.71 v27.75,9.71 | R8.1 8.25,40.4 v8.25,38.86
  Bottom 0.254: v8.25,38.86 8.25,38.76 8.25,22.86 21.4,9.71 v27.75,9.71
UCAP
  Top 0.254: U1.6 18.75,16.86 15.79,16.86 C8.1
V_HIGH
  pour Top: 45.55,7.21 53.15,7.21 53.15,0.71 45.55,0.71
  pour Bottom: 57.55,46.81 64.45,46.81 64.65,46.61 64.65,12.21 53.25,0.81 45.45,0.81 45.45,7.31 53.15,7.31 57.55,11.71
VIN
  Top 0.508: R4.2 13.87,41.8 T1.3 12.18,42.14 T2.1
VUSB  (via drill 0.35)
  Top 0.254: U1.7 v17.05,16.16
  Top 0.508: T1.1 12.31,39.01 R11.2 C11.1 12.31,32.97 F1.2 11.2,31.16 9.9,29.86 9.8,29.86 | 9.8,29.86 X7.VBUS | 9.8,29.86 9.51,29.86 v9.46,29.91
  Bottom 0.254: v17.05,16.16 16.18,16.16 9.16,23.18 9.16,29.61 v9.46,29.91
VUSBD
  Top 0.508: F1.1 11.2,28.66 C10.+
XTAL1
  Top 0.254: U1.17 24.65,10.26 24.55,10.16 24.55,9.6 28.4,5.75 C5.2 26.38,3.22 X1.3
XTAL2
  Top 0.254: U1.16 23.85,10.36 24.05,10.16 24.05,9.38 25.63,7.81 25.63,6.61 X1.1 22.86,5.51 C1.2

### Text on the board
tPlace: A5 | A4 | A3 | A2 | A1 | A0 | 5~ | 9~ | 10~ | 11~ | RS-485 | B | A | B | A | 7 | only R23 for L.P | 6~ | only R28 for L.P | J3 | 12 | GND RST / MOSI SCK / +5V MISO | only R34 for L.P | MODULE | 4 | SCL | - + | only R31 for L.P | SDA | GND | +5V
bPlace: ATMEGA32u4 Breakout v1 | 18/09/2019 | by Rayan Armani
200bmp: C:/Users/rarma/Desktop/logo.bmp